# Altium schematic sheet Sensors.SchDoc
size A; DocumentNumber: 3; SheetNumber: 3; SheetTotal: 4
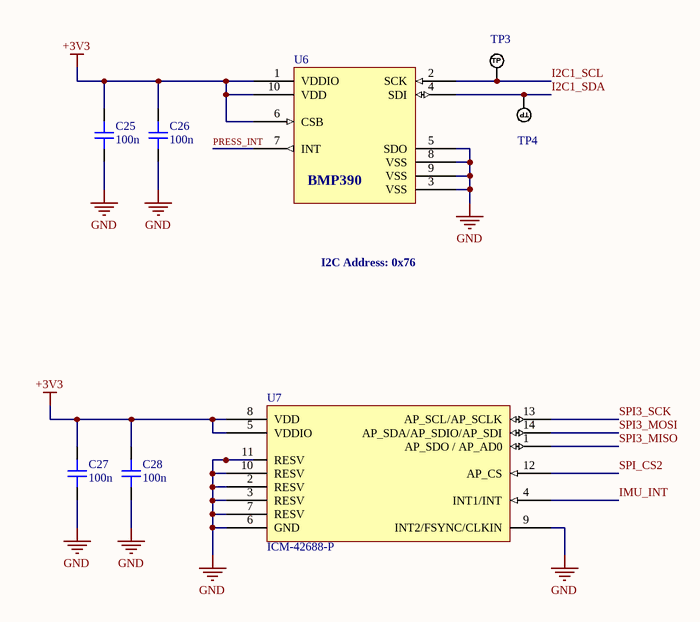
[diagram p0: Sensors.SchDoc]

## Parts
C25  100n  [CAP_0402]
C26  100n  [CAP_0402]
C27  100n  [CAP_0402]
C28  100n  [CAP_0402]
TP3  TP_NOBOM  [PAD_RND_1MM]  (value not drawn)  (no BOM)
TP4  TP_NOBOM  [PAD_RND_1MM]  (value not drawn)  (no BOM)
U6  BMP390  [LGA 10-pin ball]
U7  ICM-42688-P  [14 Lead LGA]

## Nets
+3V3: C25.2 C26.2 C27.2 C28.2 U6.1(VDDIO) U6.6(CSB) U6.10(VDD) U7.5(VDDIO) U7.8(VDD)
GND: C25.1 C26.1 C27.1 C28.1 U6.3(VSS) U6.5(SDO) U6.8(VSS) U6.9(VSS) U7.2(RESV) U7.3(RESV) U7.6(GND) U7.7(RESV) U7.9(INT2/FSYNC/CLKIN) U7.10(RESV) U7.11(RESV)
I2C1_SCL: TP3.1(TP) U6.2(SCK)
I2C1_SDA: TP4.1(TP) U6.4(SDI)
IMU_INT: U7.4(INT1/INT)
PRESS_INT: U6.7(INT)
SPI3_MISO: U7.1(AP_SDO_/_AP_AD0)
SPI3_MOSI: U7.14(AP_SDA/AP_SDIO/AP_SDI)
SPI3_SCK: U7.13(AP_SCL/AP_SCLK)
SPI_CS2: U7.12(AP_CS)

## Notes on the sheet
- I2C Address: 0x76

## Library data of the parts
C25-C28 = CAP_0402: Capacitor SMD 0402; Manufacturer: *; Manufacturer Part Number: *; Distributor Link: *; LCSC: *; Rating: *; Dielectric: *
TP3 TP4 = TEST_POINT_RND_1MM: Test Point Round 1mm (NO BOM)
U6 = BMP390: Pressure Sensor 4.35 ~ 18.13PSI (30 ~ 125kPa) Absolute 10-WFLGA
U7 = ICM-42688-P: High Precision 6-Axis MEMS MotionTrackingTM Device